# Altium schematic sheet FPGA_POWER.SchDoc
size 420 x 297 mm; SheetNumber: 28; SheetTotal: 32
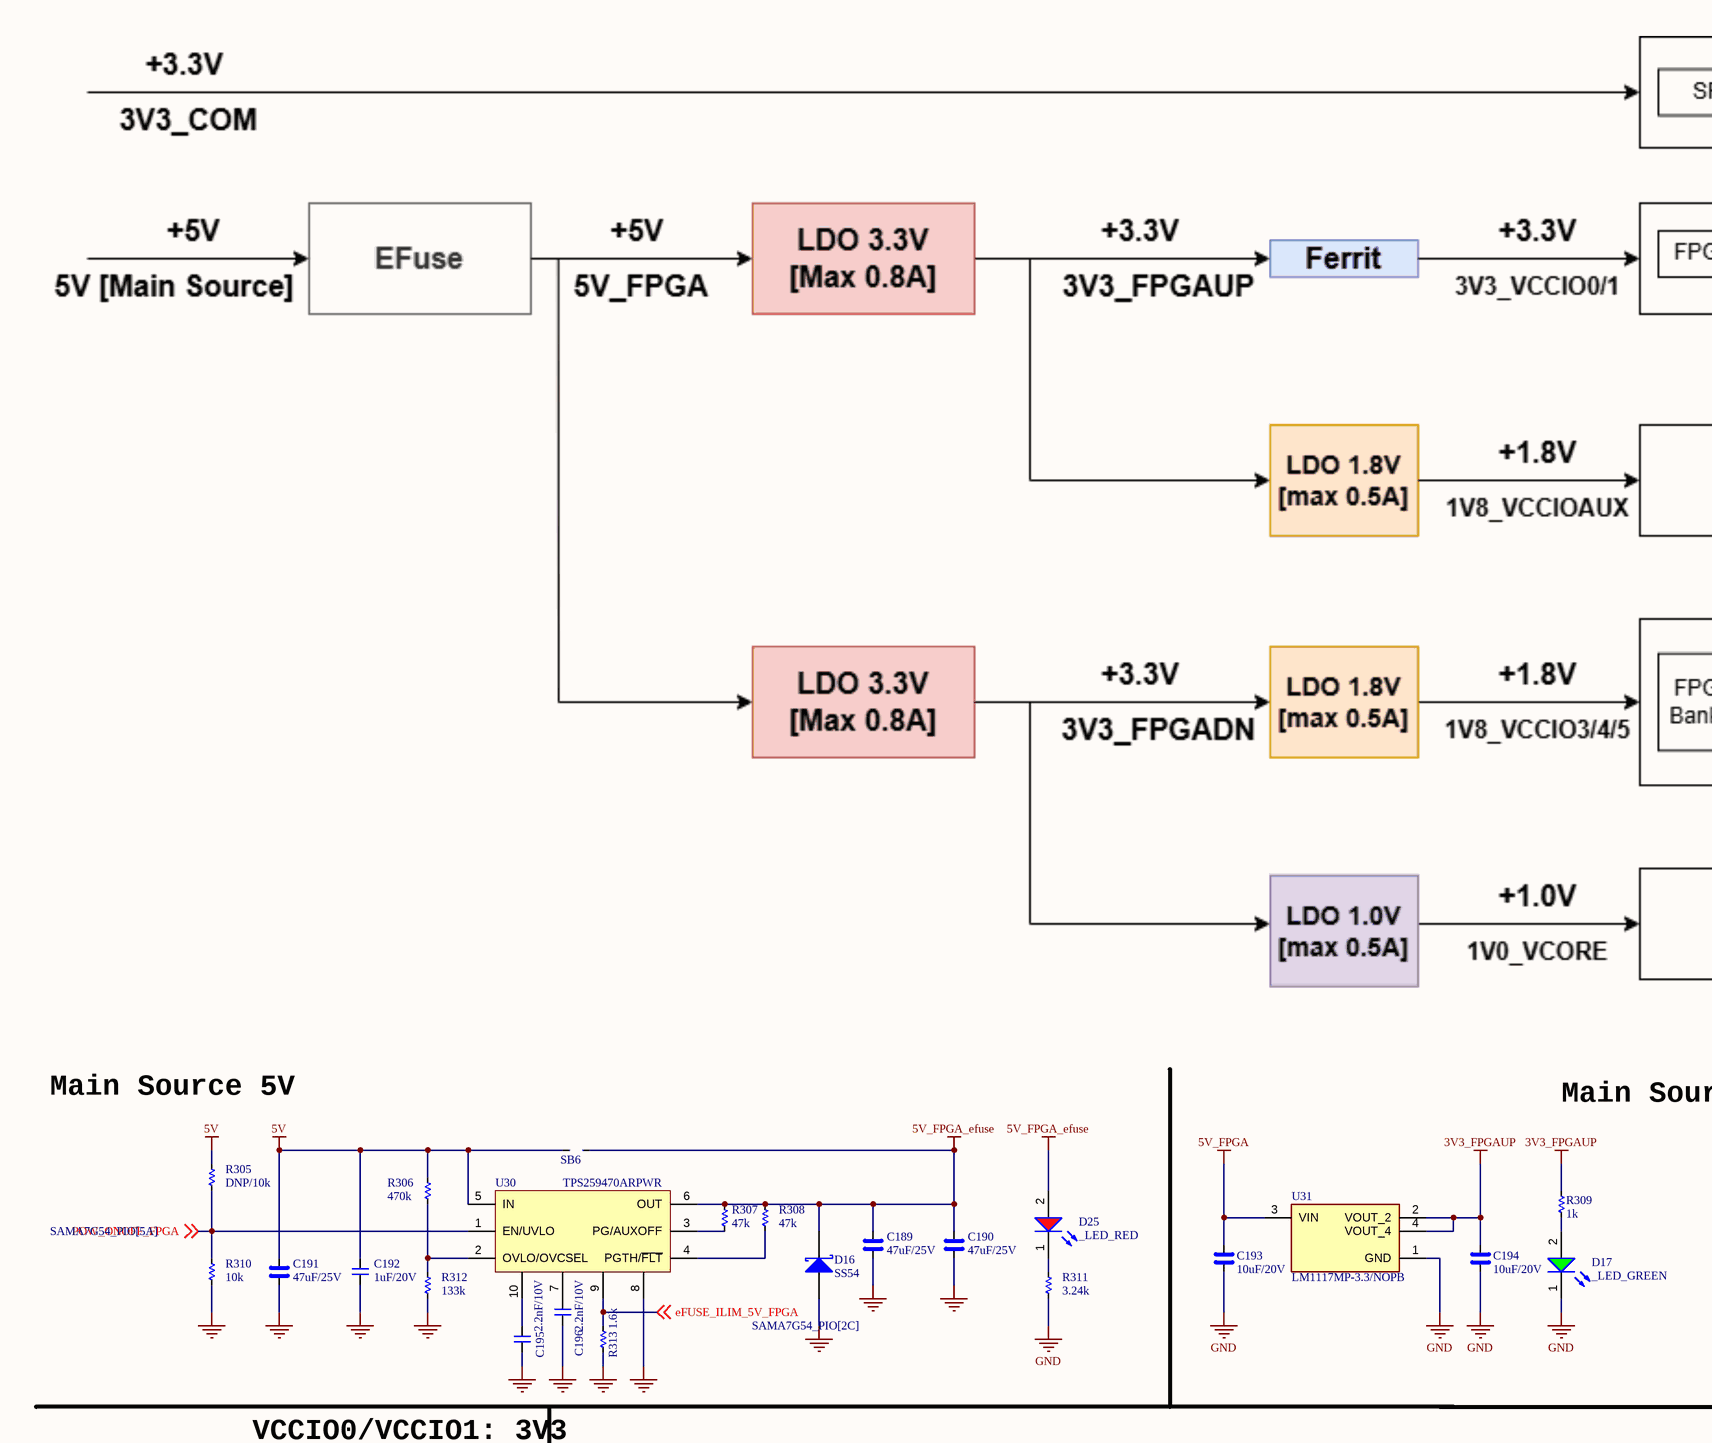
[diagram p0: FPGA_POWER.SchDoc, top left]
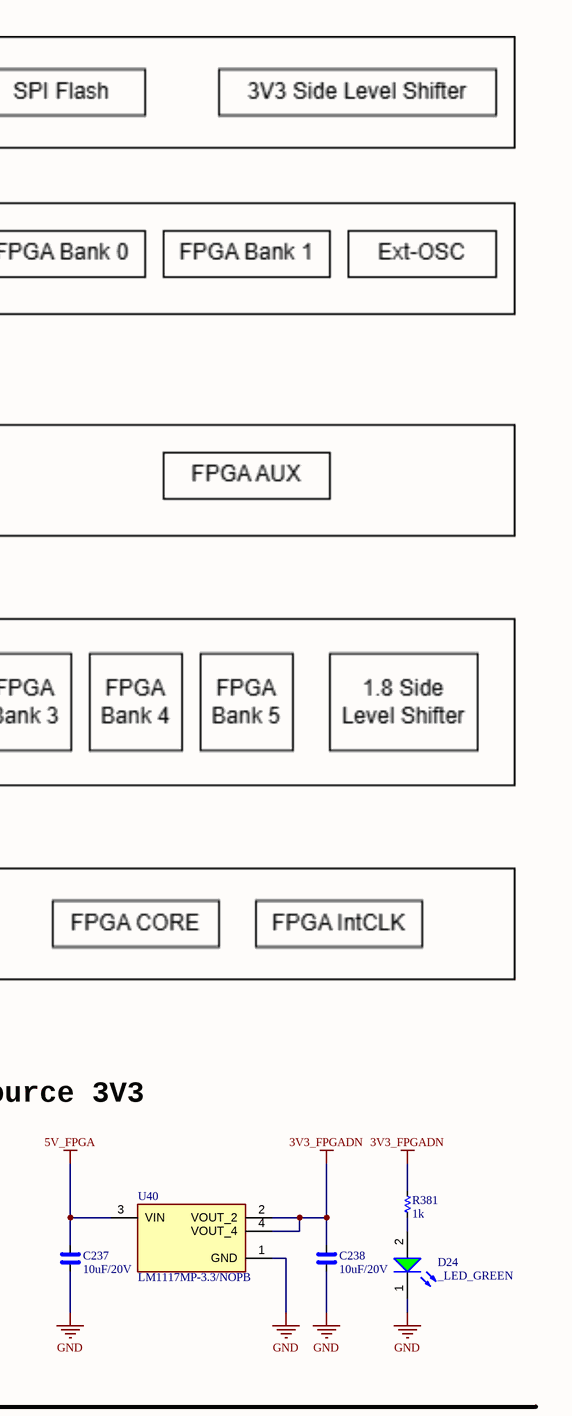
[diagram p1: FPGA_POWER.SchDoc, top right]
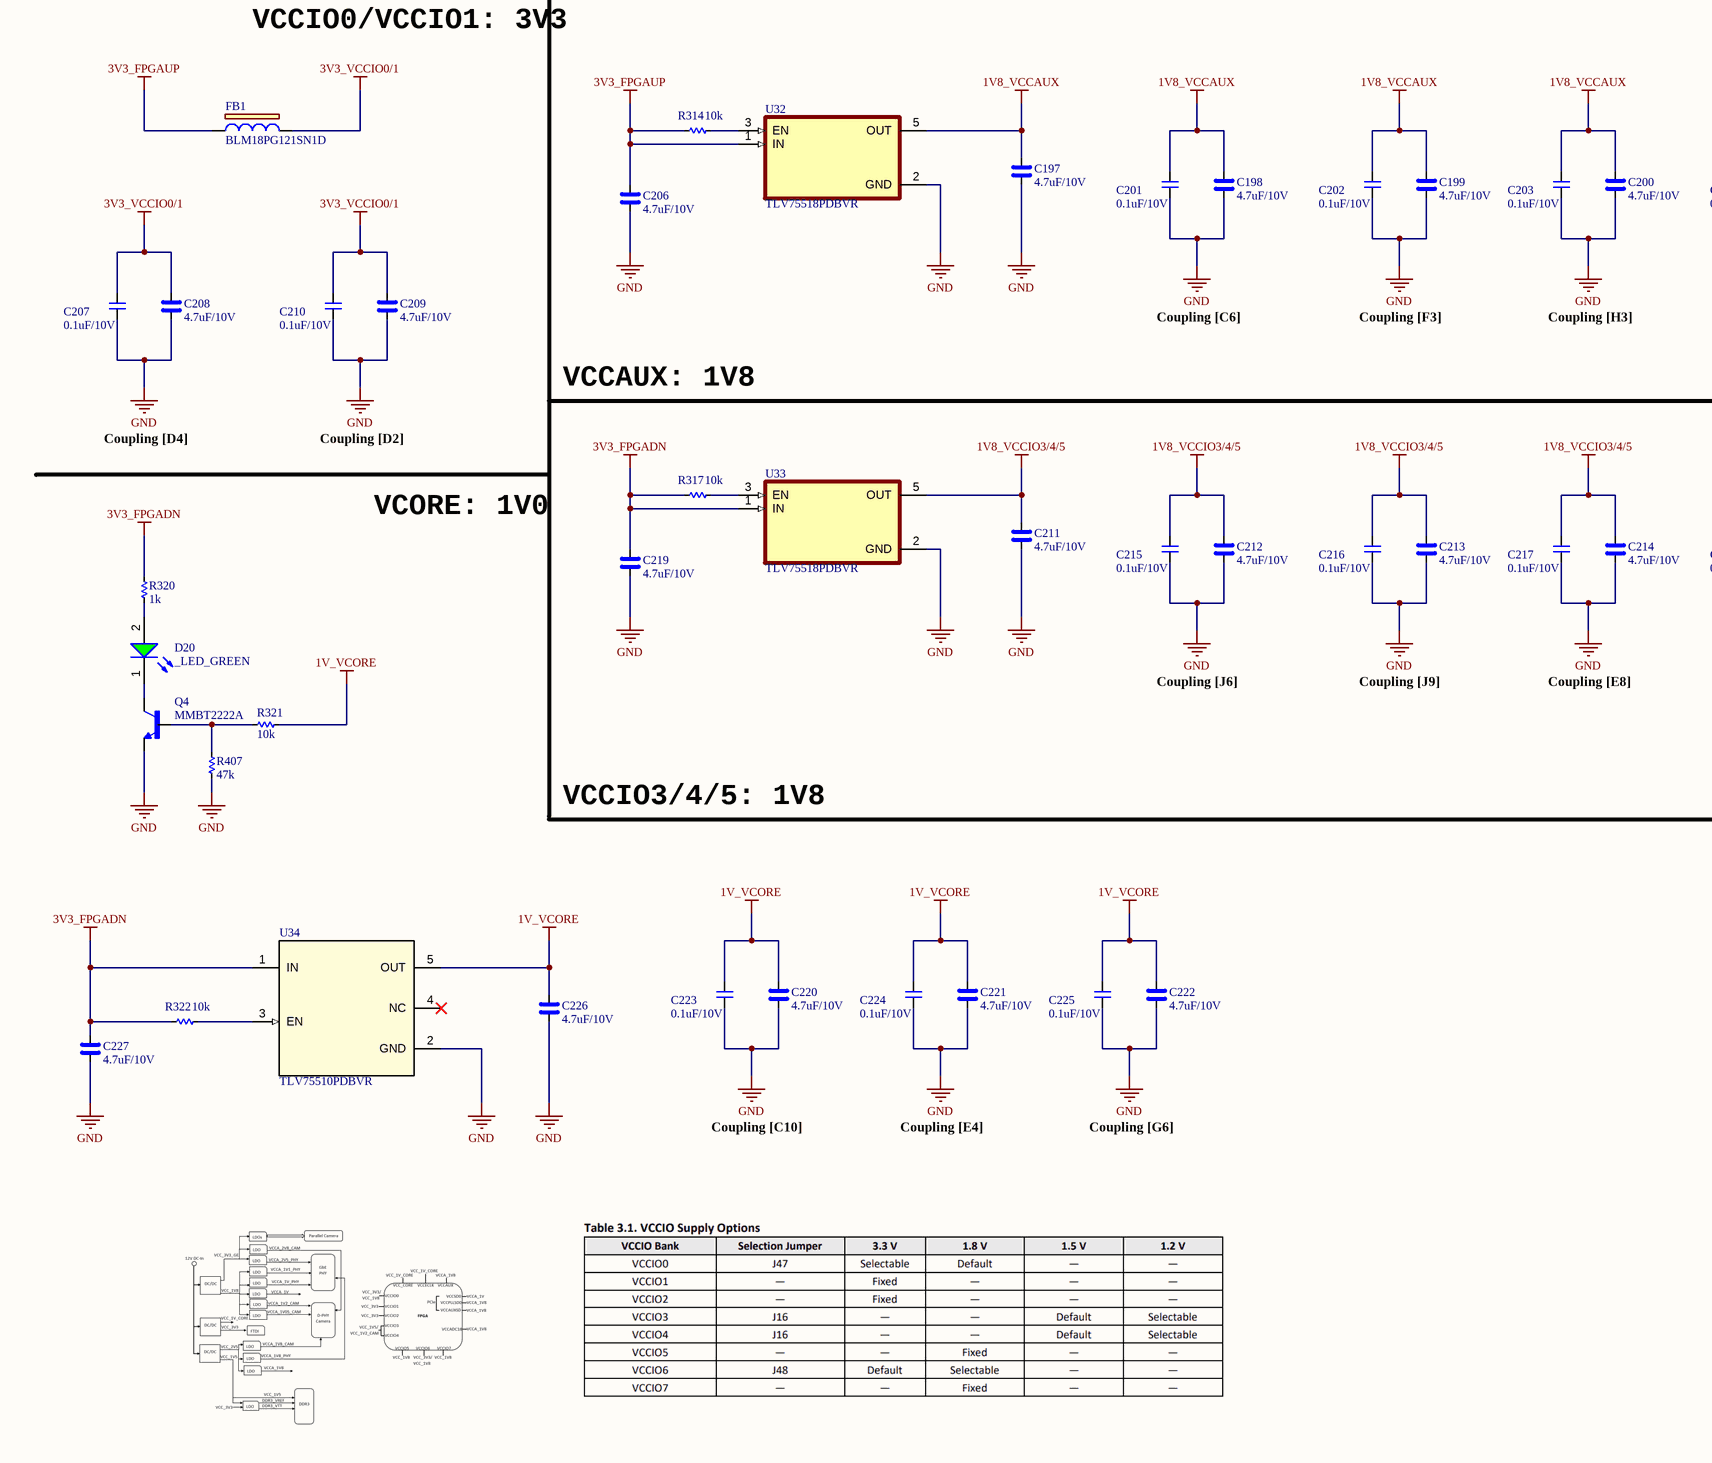
[diagram p2: FPGA_POWER.SchDoc, bottom left]
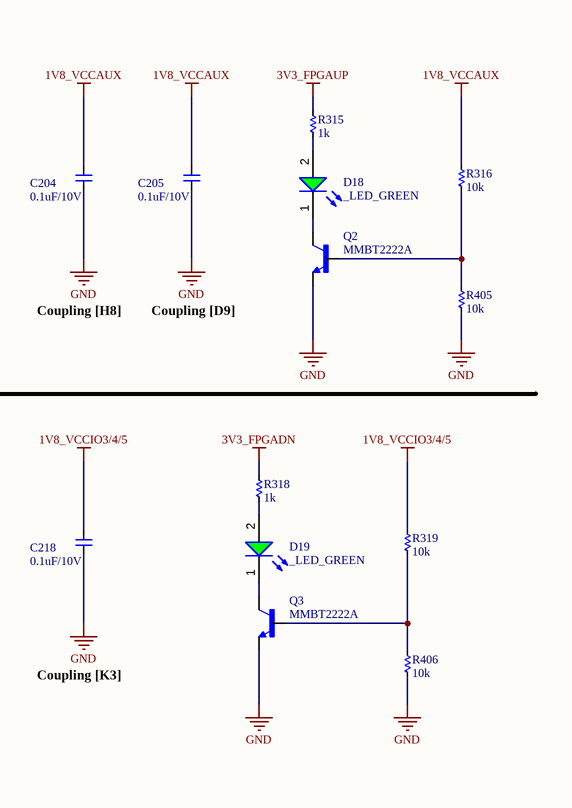
[diagram p3: FPGA_POWER.SchDoc, bottom right]

## Parts
C189  47uF/25V  [CAP_C_3225X80]
C190  47uF/25V  [CAP_C_3225X80]
C191  47uF/25V  [CAP_C_3225X80]
C192  1uF/20V  [CAP_C_1005X50_L]
C193  10uF/20V  [CAP_C_1608X80_L]
C194  10uF/20V  [CAP_C_1608X80_L]
C195  2.2nF/10V  [CAP_C_1005X50_L]
C196  2.2nF/10V  [CAP_C_1005X50_L]
C197  4.7uF/10V  [CAP_C_2012X110]
C198  4.7uF/10V  [CAP_C_1005X50_L]
C199  4.7uF/10V  [CAP_C_1005X50_L]
C200  4.7uF/10V  [CAP_C_1005X50_L]
C201  0.1uF/10V  [CAP_C_0603x30]
C202  0.1uF/10V  [CAP_C_0603x30]
C203  0.1uF/10V  [CAP_C_0603x30]
C204  0.1uF/10V  [CAP_C_0603x30]
C205  0.1uF/10V  [CAP_C_0603x30]
C206  4.7uF/10V  [CAP_C_2012X110]
C207  0.1uF/10V  [CAP_C_0603x30]
C208  4.7uF/10V  [CAP_C_1005X50_L]
C209  4.7uF/10V  [CAP_C_1005X50_L]
C210  0.1uF/10V  [CAP_C_0603x30]
C211  4.7uF/10V  [CAP_C_2012X110]
C212  4.7uF/10V  [CAP_C_1005X50_L]
C213  4.7uF/10V  [CAP_C_1005X50_L]
C214  4.7uF/10V  [CAP_C_1005X50_L]
C215  0.1uF/10V  [CAP_C_0603x30]
C216  0.1uF/10V  [CAP_C_0603x30]
C217  0.1uF/10V  [CAP_C_0603x30]
C218  0.1uF/10V  [CAP_C_0603x30]
C219  4.7uF/10V  [CAP_C_2012X110]
C220  4.7uF/10V  [CAP_C_1005X50_L]
C221  4.7uF/10V  [CAP_C_1005X50_L]
C222  4.7uF/10V  [CAP_C_1005X50_L]
C223  0.1uF/10V  [CAP_C_0603x30]
C224  0.1uF/10V  [CAP_C_0603x30]
C225  0.1uF/10V  [CAP_C_0603x30]
C226  4.7uF/10V  [CAP_C_2012X110]
C227  4.7uF/10V  [CAP_C_2012X110]
C237  10uF/20V  [CAP_C_1608X80_L]
C238  10uF/20V  [CAP_C_1608X80_L]
D16  SS54  [DO-214AC_SMA]
D17  _LED_GREEN  [LED_0603]
D18  _LED_GREEN  [LED_0603]
D19  _LED_GREEN  [LED_0603]
D20  _LED_GREEN  [LED_0603]
D24  _LED_GREEN  [LED_0603]
D25  _LED_RED  [LED_0603]
FB1  BLM18PG121SN1D  [IND_C_1608X60]
Q2  MMBT2222A  [SOT95P240X120-3N]
Q3  MMBT2222A  [SOT95P240X120-3N]
Q4  MMBT2222A  [SOT95P240X120-3N]
R305  DNP/10k  [RES_C_1005x30_L]
R306  470k  [RES_C_1005x30_L]
R307  47k  [RES_C_1005x30_L]
R308  47k  [RES_C_1005x30_L]
R309  1k  [RES_C_1005x30_L]
R310  10k  [RES_C_1005x30_L]
R311  3.24k  [RES_C_1005x30_L]
R312  133k  [RES_C_1005x30_L]
R313  1.6k  [RES_C_1005x30_L]
R314  10k  [RES_C_1005x30_L]
R315  1k  [RES_C_1005x30_L]
R316  10k  [RES_C_1005x30_L]
R317  10k  [RES_C_1005x30_L]
R318  1k  [RES_C_1005x30_L]
R319  10k  [RES_C_1005x30_L]
R320  1k  [RES_C_1005x30_L]
R321  10k  [RES_C_1005x30_L]
R322  10k  [RES_C_1005x30_L]
R381  1k  [RES_C_1005x30_L]
R405  10k  [RES_C_1005x30_L]
R406  10k  [RES_C_1005x30_L]
R407  47k  [RES_C_1005x30_L]
SB6  JUMPER  [JUMPER_1608]  (value not drawn)
U30  TPS259470ARPWR  [VQFN-HR-10]
U31  LM1117MP-3.3/NOPB  [VREG_LM1117MP-3.3/NOPB]
U32  TLV75518PDBVR  [DBV0005A_N]
U33  TLV75518PDBVR  [DBV0005A_N]
U34  TLV75510PDBVR  [DBV0005A_N]
U40  LM1117MP-3.3/NOPB  [VREG_LM1117MP-3.3/NOPB]

## Nets
1V8_VCCAUX: C197.2 C198.2 C199.2 C200.2 C201.2 C202.2 C203.2 C204.2 C205.2 R316.1 U32.5(OUT)
1V8_VCCIO3/4/5: C211.2 C212.2 C213.2 C214.2 C215.2 C216.2 C217.2 C218.2 R319.1 U33.5(OUT)
1V_VCORE: C220.2 C221.2 C222.2 C223.2 C224.2 C225.2 C226.2 R321.1 U34.5(OUT)
3V3_FPGADN: C219.2 C227.2 C238.2 R317.1 R318.2 R320.2 R322.1 R381.2 U33.1(IN) U34.1(IN) U40.2(VOUT_2) U40.4(VOUT_4)
3V3_FPGAUP: C194.2 C206.2 FB1.2 R309.2 R314.1 R315.2 U31.2(VOUT_2) U31.4(VOUT_4) U32.1(IN)
3V3_VCCIO0/1: C207.2 C208.2 C209.2 C210.2 FB1.1
5V: C191.2 C192.2 R305.1 R306.2 SB6.1 U30.5(IN)
5V_FPGA: C193.2 C237.2 U31.3(VIN) U40.3(VIN)
5V_FPGA_efuse: C189.2 C190.2 D16.1(K) D25.2(A) R307.2 R308.2 SB6.2 U30.6(OUT)
GND: C189.1 C190.1 C191.1 C192.1 C193.1 C194.1 C195.1 C196.1 C197.1 C198.1 C199.1 C200.1 C201.1 C202.1 C203.1 C204.1 C205.1 C206.1 C207.1 C208.1 C209.1 C210.1 C211.1 C212.1 C213.1 C214.1 C215.1 C216.1 C217.1 C218.1 C219.1 C220.1 C221.1 C222.1 C223.1 C224.1 C225.1 C226.1 C227.1 C237.1 C238.1 D16.2(A) D17.1(K) D24.1(K) Q2.2(E) Q3.2(E) Q4.2(E) R310.2 R311.1 R312.1 R313.1 R405.2 R406.2 R407.1 U30.8 U31.1(GND) U32.2(GND) U33.2(GND) U34.2(GND) U40.1(GND)
eFUSE_ILIM_5V_FPGA: R313.2 U30.9 ; off-sheet eFUSE_ILIM_5V_FPGA
POW_ONOFF_FPGA: R305.2 R310.1 U30.1(EN/UVLO) ; off-sheet POW_ONOFF_FPGA
NetC195_2: C195.2 U30.10
NetC196_2: C196.2 U30.7
NetD17_2: D17.2(A) R309.1
NetD18_1: D18.1(K) Q2.3(C)
NetD18_2: D18.2(A) R315.1
NetD19_1: D19.1(K) Q3.3(C)
NetD19_2: D19.2(A) R318.1
NetD20_1: D20.1(K) Q4.3(C)
NetD20_2: D20.2(A) R320.1
NetD24_2: D24.2(A) R381.1
NetD25_1: D25.1(K) R311.2
NetQ2_1: Q2.1(B) R316.2 R405.1
NetQ3_1: Q3.1(B) R319.2 R406.1
NetQ4_1: Q4.1(B) R321.2 R407.2
NetR306_1: R306.1 R312.2 U30.2(OVLO/OVCSEL)
NetR307_1: R307.1 U30.3(PG/AUXOFF)
NetR308_1: R308.1 U30.4(PGTH/~{FLT})
NetR314_2: R314.2 U32.3(EN)
NetR317_2: R317.2 U33.3(EN)
NetR322_2: R322.2 U34.3(EN)

Not connected (* = marked no-connect by the designer): U34 4(NC)*

## Notes on the sheet
- Main Source 5V
- Main Source 3V3
- VCCIO0/VCCIO1: 3V3
- Coupling [C6]
- Coupling [F3]
- Coupling [H3]
- Coupling [H8]
- Coupling [D9]
- VCCAUX: 1V8
- Coupling [D4]
- Coupling [D2]
- VCORE: 1V0
- Coupling [J6]
- Coupling [J9]
- Coupling [E8]
- Coupling [K3]
- VCCIO3/4/5: 1V8
- Coupling [C10]
- Coupling [E4]
- Coupling [G6]
- Project:
- Sub-system:
- Design by:
- Sheet title:
- Sheet
- A3
- of
- Checked by:
- Approved by:
- Revision:
- Document No:
- Size:
- Date:

## Library data of the parts
C189-C191 C193 C194 C197 C206 C211 C219 C226 C227 C237 C238 = _CAP_C_High_2: CAP CHIP High Value
C192 C195 C196 = _CAP_C_2: CAP CHIP
C198-C200 C208 C209 C212-C214 C220-C222 = _CAP_C_High_2: CAP
C201-C205 C207 C210 C215-C218 C223-C225 = _CAP_C_2: CAP
D16 = SS54: DIODE SCHOTTKY 40V 5A SMA; MPN: SS34; Solder: SMT; Value: SS34; MFR: *
D17-D20 D24 = LED_GREEN: LED GREEN CLEAR 0603 SMD
D25 = LED_RED: LED RED CLEAR 0603 SMD
FB1 = BLM18PG121SN1D: FERRITE BEAD 120 OHM 0603 1LN; Manufacturer_Name: Murata; Copyright: Copyright (C) 2025 Ultra Librarian. All rights reserved.; Manufacturer_Part_Number: BLM18PG121SN1D
Q2-Q4 = BJT_NPN_BEC: MF: Diotec Semiconductor; SnapEDA_Link: https://www.snapeda.com/parts/MMBT2222A/Diotec/view-part/?ref=snap; Package: SOT-23 Diotec; Value: *; MP: MMBT2222A; Check_prices: https://www.snapeda.com/parts/MMBT2222A/Diotec/view-part/?ref=eda
R305-R322 R381 R405-R407 = _RES_B_2: RES
U31 U40 = LM1117MP-3.3/NOPB: 800-mA 15-V linear voltage regulator; MF: Texas Instruments; SnapEDA_Link: https://www.snapeda.com/parts/LM1117MP-3.3/NOPB/Texas+Instruments/view-part/?ref=snap; Package: SOT-223-4 Texas Instruments; Value: *; MP: LM1117MP-3.3/NOPB; Check_prices: https://www.snapeda.com/parts/LM1117MP-3.3/NOPB/Texas+Instruments/view-part/?ref=eda
U32 U33 = TLV75518PDBVR: 500-mA high-PSRR low-IQ low-dropout voltage regulator with enable; MF: Texas Instruments; SnapEDA_Link: https://www.snapeda.com/parts/TLV75518PDBVR/Texas+Instruments/view-part/?ref=snap; Package: SOT-23-5 Texas Instruments; Value: *; MP: TLV75518PDBVR; Check_prices: https://www.snapeda.com/parts/TLV75518PDBVR/Texas+Instruments/view-part/?ref=eda
U34 = TLV75510PDBVR: 500mA high-PSRR low-I<sub>Q</sub> low-dropout voltage regulator with enable 5-SOT-23 -40 to 125; Manufacturer_Name: Texas Instruments; TYPE: TYPE; RefDes: RefDes; Copyright: Copyright (C) 2025 Ultra Librarian. All rights reserved.; Manufacturer_Part_Number: TLV75510PDBVR